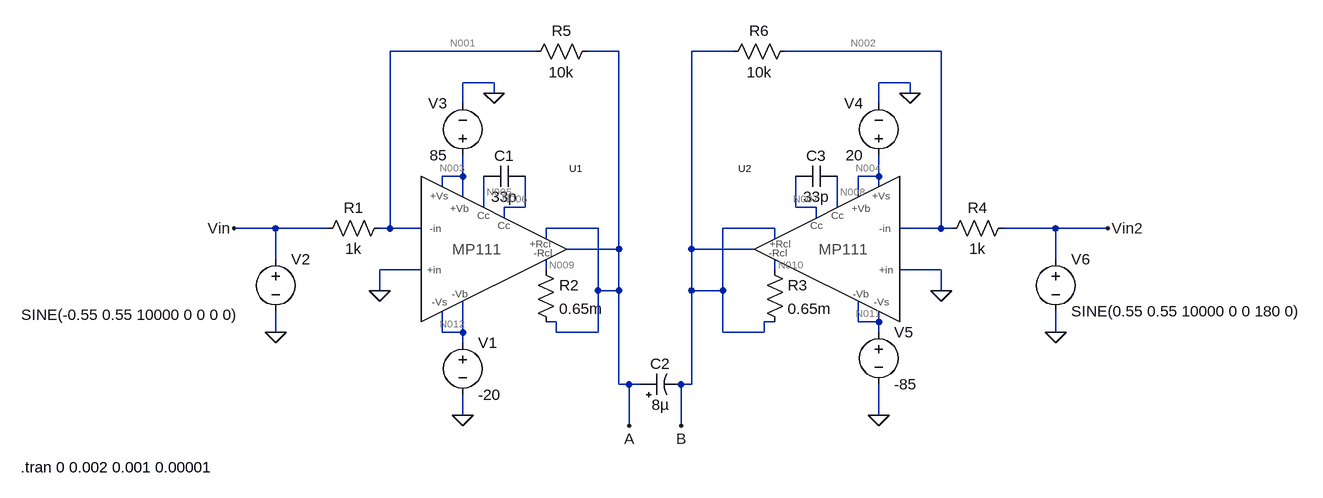
[diagram p0: schematic opamp_bridge.asc]
opamp_bridge.asc, the LTspice schematic file:
Version 4
SHEET 1 1432 680
WIRE 208 -144 -16 -144
WIRE 336 -144 288 -144
WIRE 512 -144 448 -144
WIRE 832 -144 592 -144
WIRE 144 -96 96 -96
WIRE 784 -96 736 -96
WIRE 144 -80 144 -96
WIRE 784 -80 784 -96
WIRE 96 -64 96 -96
WIRE 736 -64 736 -96
WIRE 96 48 96 16
WIRE 96 48 64 48
WIRE 736 48 736 16
WIRE 736 48 704 48
WIRE 64 64 64 48
WIRE 736 64 736 48
WIRE 96 80 96 48
WIRE 704 80 704 48
WIRE 128 96 128 48
WIRE 192 96 192 48
WIRE 192 96 160 96
WIRE 608 96 608 48
WIRE 640 96 608 96
WIRE 672 96 672 48
WIRE 160 112 160 96
WIRE 640 112 640 96
WIRE -192 128 -256 128
WIRE -112 128 -192 128
WIRE -16 128 -16 -144
WIRE -16 128 -32 128
WIRE 32 128 -16 128
WIRE 304 128 224 128
WIRE 576 128 496 128
WIRE 832 128 832 -144
WIRE 832 128 768 128
WIRE 848 128 832 128
WIRE 1008 128 928 128
WIRE 1088 128 1008 128
WIRE 224 144 224 128
WIRE 576 144 576 128
WIRE 336 160 336 -144
WIRE 336 160 256 160
WIRE 448 160 448 -144
WIRE 544 160 448 160
WIRE -192 176 -192 128
WIRE 1008 176 1008 128
WIRE 32 192 -32 192
WIRE 224 192 224 176
WIRE 576 192 576 176
WIRE 832 192 768 192
WIRE -32 224 -32 192
WIRE 304 224 304 128
WIRE 336 224 336 160
WIRE 336 224 304 224
WIRE 448 224 448 160
WIRE 496 224 496 128
WIRE 496 224 448 224
WIRE 832 224 832 192
WIRE 240 272 224 272
WIRE 576 272 560 272
WIRE 704 272 704 240
WIRE 736 272 736 256
WIRE 736 272 704 272
WIRE -192 288 -192 256
WIRE 64 288 64 256
WIRE 96 288 96 240
WIRE 96 288 64 288
WIRE 240 288 240 272
WIRE 304 288 304 224
WIRE 304 288 240 288
WIRE 496 288 496 224
WIRE 560 288 560 272
WIRE 560 288 496 288
WIRE 736 288 736 272
WIRE 1008 288 1008 256
WIRE 96 304 96 288
WIRE 336 368 336 224
WIRE 352 368 336 368
WIRE 368 368 352 368
WIRE 432 368 416 368
WIRE 448 368 448 224
WIRE 448 368 432 368
WIRE 96 416 96 384
WIRE 736 416 736 368
WIRE 352 432 352 368
WIRE 432 432 432 368
FLAG 96 416 0
FLAG -192 288 0
FLAG 144 -80 0
FLAG 784 -80 0
FLAG 736 416 0
FLAG -32 224 0
FLAG 832 224 0
FLAG 1008 288 0
FLAG -256 128 Vin
FLAG 1088 128 Vin2
FLAG 352 432 A
FLAG 432 432 B
SYMBOL MP111 48 160 R0
SYMATTR InstName U1
SYMBOL MP111 752 160 M0
SYMATTR InstName U2
SYMBOL voltage 96 288 R0
WINDOW 123 0 0 Left 0
WINDOW 39 24 124 Left 2
SYMATTR InstName V1
SYMATTR Value -20
SYMBOL voltage -192 160 R0
WINDOW 3 -391 101 Left 2
WINDOW 123 0 0 Left 0
WINDOW 39 0 0 Left 0
SYMATTR InstName V2
SYMATTR Value SINE(-0.55 0.55 10000 0 0 0 0)
SYMBOL voltage 96 32 R180
WINDOW 0 24 96 Left 2
WINDOW 3 24 16 Left 2
WINDOW 123 0 0 Left 0
WINDOW 39 0 0 Left 0
SYMATTR InstName V3
SYMATTR Value 85
SYMBOL voltage 736 32 R180
WINDOW 0 24 96 Left 2
WINDOW 3 24 16 Left 2
WINDOW 123 0 0 Left 0
WINDOW 39 0 0 Left 0
SYMATTR InstName V4
SYMATTR Value 20
SYMBOL voltage 736 272 R0
WINDOW 123 0 0 Left 0
WINDOW 39 0 0 Left 0
SYMATTR InstName V5
SYMATTR Value -85
SYMBOL voltage 1008 160 R0
WINDOW 123 0 0 Left 0
WINDOW 39 0 0 Left 0
SYMATTR InstName V6
SYMATTR Value SINE(0.55 0.55 10000 0 0 180 0)
SYMBOL res -16 112 R90
WINDOW 0 0 56 VBottom 2
WINDOW 3 32 56 VTop 2
SYMATTR InstName R1
SYMATTR Value 1k
SYMBOL res 208 176 R0
SYMATTR InstName R2
SYMATTR Value 0.65m
SYMBOL polcap 368 384 R270
WINDOW 0 32 32 VTop 2
WINDOW 3 0 32 VBottom 2
SYMATTR InstName C2
SYMATTR Value 8µ
SYMBOL res 560 176 R0
SYMATTR InstName R3
SYMATTR Value 0.65m
SYMBOL cap 192 32 R90
WINDOW 0 0 32 VBottom 2
WINDOW 3 32 32 VTop 2
SYMATTR InstName C1
SYMATTR Value 33p
SYMBOL cap 672 32 R90
WINDOW 0 0 32 VBottom 2
WINDOW 3 32 32 VTop 2
SYMATTR InstName C3
SYMATTR Value 33p
SYMBOL res 944 112 R90
WINDOW 0 0 56 VBottom 2
WINDOW 3 32 56 VTop 2
SYMATTR InstName R4
SYMATTR Value 1k
SYMBOL res 304 -160 R90
WINDOW 0 0 56 VBottom 2
WINDOW 3 32 56 VTop 2
SYMATTR InstName R5
SYMATTR Value 10k
SYMBOL res 608 -160 R90
WINDOW 0 0 56 VBottom 2
WINDOW 3 32 56 VTop 2
SYMATTR InstName R6
SYMATTR Value 10k
TEXT -584 496 Left 2 !.tran 0 0.002 0.001 0.00001

The netlist it stands for:
* opamp_bridge.asc
XU1 0 N001 A N009 A N003 N012 N005 N006 N003 N012 MP111 MP111  ; pins +in -in +Rcl -Rcl out +Vb -Vb Cc1 Cc2 +Vs -Vs
XU2 0 N002 B N010 B N004 N011 N008 N007 N004 N011 MP111 MP111  ; pins +in -in +Rcl -Rcl out +Vb -Vb Cc1 Cc2 +Vs -Vs
V1 N012 0 -20
V2 Vin 0 SINE(-0.55 0.55 10000 0 0 0 0)
V3 N003 0 85
V4 N004 0 20
V5 N011 0 -85
V6 Vin2 0 SINE(0.55 0.55 10000 0 0 180 0)
R1 N001 Vin 1k
R2 N009 A 0.65m
C2 A B 8µ
R3 N010 B 0.65m
C1 N006 N005 33p
C3 N008 N007 33p
R4 Vin2 N002 1k
R5 A N001 10k
R6 N002 B 10k
.tran 0 0.002 0.001 0.00001
.lib MP111.lib
.backanno
.end

* Results of the author's LTspice run, read from the files saved beside the schematic
* Operating Point, zero values left out:
*   V(n003) = 85 V
*   V(n012) = -20 V
*   V(n006) = 10.17 V
*   V(n005) = 80.33 V
*   V(n009) = 5.519 V
*   V(a) = 5.519 V
*   V(n001) = 1.721 mV
*   V(n004) = 20 V
*   V(n011) = -85 V
*   V(n007) = -823.4 mV
*   V(n008) = 15.04 V
*   V(n010) = -5.481 V
*   V(b) = -5.481 V
*   V(n002) = 1.746 mV
*   V(vin) = -550 mV
*   V(vin2) = 550 mV
*   I(R1) = 551.7 µA
*   I(R2) = -1.366 pA
*   I(R3) = 1.366 pA
*   I(R4) = 548.3 µA
*   I(R5) = 551.7 µA
*   I(R6) = 548.3 µA
*   I(V1) = 144.7 mA
*   I(V2) = 551.7 µA
*   I(V3) = -145.3 mA
*   I(V4) = -153 mA
*   I(V5) = 153.5 mA
*   I(V6) = -548.3 µA
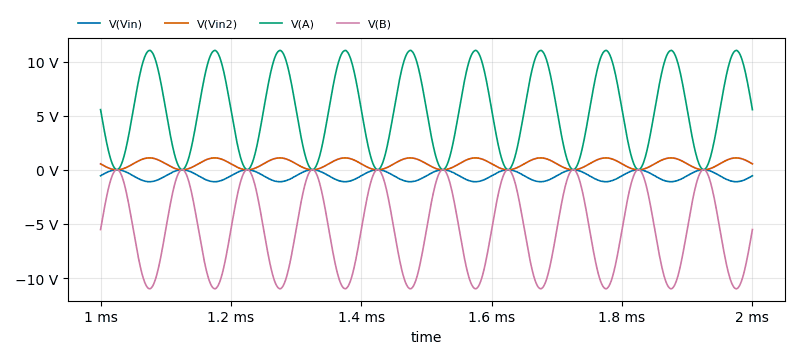
[diagram p1: Transient Analysis of opamp_bridge.asc, plotted from the saved traces]
* Transient Analysis, 1 run:
*   V(Vin): min -1.1 V, max -3.451 µV, average -550 mV, rms 673.6 mV, last -550 mV
*   V(Vin2): min 3.451 µV, max 1.1 V, average 550 mV, rms 673.6 mV, last 550 mV
*   V(A): min 7.107 mV, max 11.03 V, average 5.518 V, rms 6.751 V, last 5.556 V
*   V(B): min -10.99 V, max 31.18 mV, average -5.48 V, rms 6.72 V, last -5.518 V